# Altium project Simulation.PrjPcb
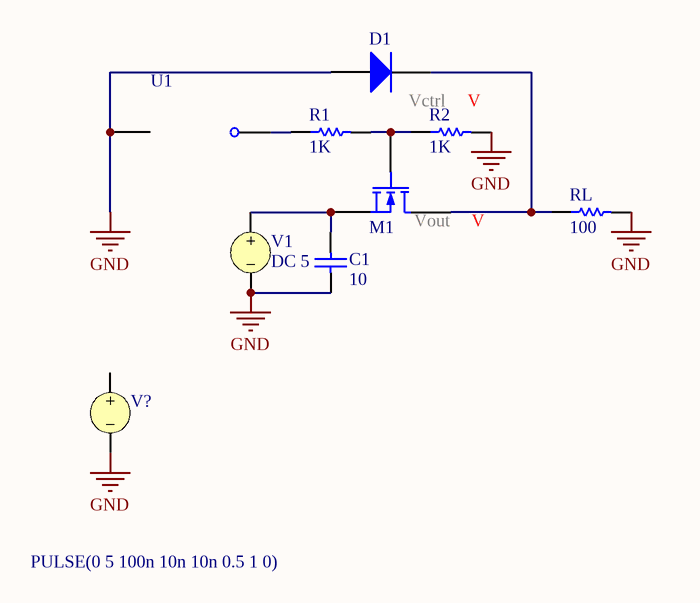
[diagram p0: Simulation.SchDoc]
1 sheet, 9 parts. Net scope: global (net labels, ports and power ports of the same name join across sheets).

## Sheet Simulation.SchDoc
size A4; SheetNumber: 1; SheetTotal: 1

### Parts
C1  value 10  (hidden comment: Capacitor)
D1  Diode  (value not drawn)
M1  N-chanel Power MOSFET VDMOS Model  (value not drawn)
R1  value 1K  (hidden comment: Resistor)
R2  value 1K  (hidden comment: Resistor)
RL  value 100  (hidden comment: Resistor)
U1  Digital NOT Gate  (value not drawn)
V1  DC 5
V?  PULSE(0 5 100n 10n 10n 0.5 1 0)

### Nets
GND: C1.2 D1.1(A) R2.2 RL.2 U1.1 V1.2 V?.2
NetC1_1: C1.1 M1.3(S) V1.1
NetD1_2: D1.2(K) M1.1(D) RL.1
NetM1_2: M1.2(G) R1.2 R2.1
NetR1_1: R1.1 U1.2

Not connected (* = marked no-connect by the designer): V? 1

### Library data of the parts
C1 = Capacitor: SimulationGenericComponent: True
D1 = Diode: AF: 1; BV: 0; BV_MAX: 1e99; EG: 1.11; FC: 0.5; IBV: 0.001; ISR: 1e-14; MJSW: 0.33; NTUN: 30; TNOM: 27; XTI: 3; SimulationGenericComponent: True; CJO: 0; CJP: 0; CTA: 0; CTP: 0; FCS: 0.5; FV_MAX: 1e99; IKF: 0; IKR: 0; JSW: 0; JTUN: 0; JTUNSW: 0; KEG: 1; KF: 0; LEVEL: 1; N: 1; NBV: 1; NR: 1; NS: 1; PHP: 1; RS: 0; TCV: 0; TLEV: 0; TLEVC: 0; TM1: 0; TM2: 0; TPB: 0; TPHP: 0; TRS: 0; TRS2: 0; TT: 0; TTT1: 0; TTT2: 0; VJ: 1; XTITUN: 3; IS: 1e-14
M1 = MOSFET N-ch VDMOS: XTI: 0; A: 1; BV: 1e30; EG: 1.11; FC: 0.5; IBV: 1e-10; IS: 1e-14; PHI: 0.6; TNOM: 27; VJ: 0.8; SimulationGenericComponent: True; CGDMAX: 0; CGDMIN: 0; CGS: 0; CJO: 0; KP: 1; KSUBTHRES: 0; LAMBDA: 0; M: 0.5; MTRIODE: 1; N: 1; NBV: 1; NCHAN: 1; RB: 0; RD: 0; RDS: 1e30; RG: 0; RQ: 0; RS: 0; SUBSHIFT: 0; SUBSLOPE: 0; THETA: 0; TT: 0; VQ: 0; VTO: 0
R1 R2 RL = Resistor: TC1: 0; SimulationGenericComponent: True; TC2: 0
U1 = Digital NOT: rise_delay_inst: 1n; input_load_inst: 1p; adc_in_low_inst: 0; adc_in_high_inst: 1; dac_out_undef_inst: 0.5; SimulationGenericComponent: True; fall_delay_inst: 1n; adc_rise_delay_inst: 1n; adc_fall_delay_inst: 1n; dac_out_low_inst: 0; dac_out_high_inst: 1; dac_input_load_inst: 1p; dac_t_rise_inst: 1n; dac_t_fall_inst: 1n
V1 = VSRC: Voltage Source; Note: PCB Footprint - Not required; AC Magnitude: 1; AC Phase: 0; Value: 5; Published: 8-Jun-2000; LatestRevisionDate: 17-Jul-2002; LatestRevisionNote: Re-released for DXP Platform.; PackageReference: Not Applicable; Publisher: Altium Limited
V? = VSRC: Voltage Source; Note: PCB Footprint - Not required; AC Magnitude: 1; AC Phase: 0; DC Magnitude: 5; Pulse Width: 0.5; Published: 8-Jun-2000; LatestRevisionDate: 17-Jul-2002; LatestRevisionNote: Re-released for DXP Platform.; PackageReference: Not Applicable; Publisher: Altium Limited; Initial Value: 0; Pulsed Value: 5; Time Delay: 100n; Rise Time: 10n; Fall Time: 10n; Period: 1; Phase: 0